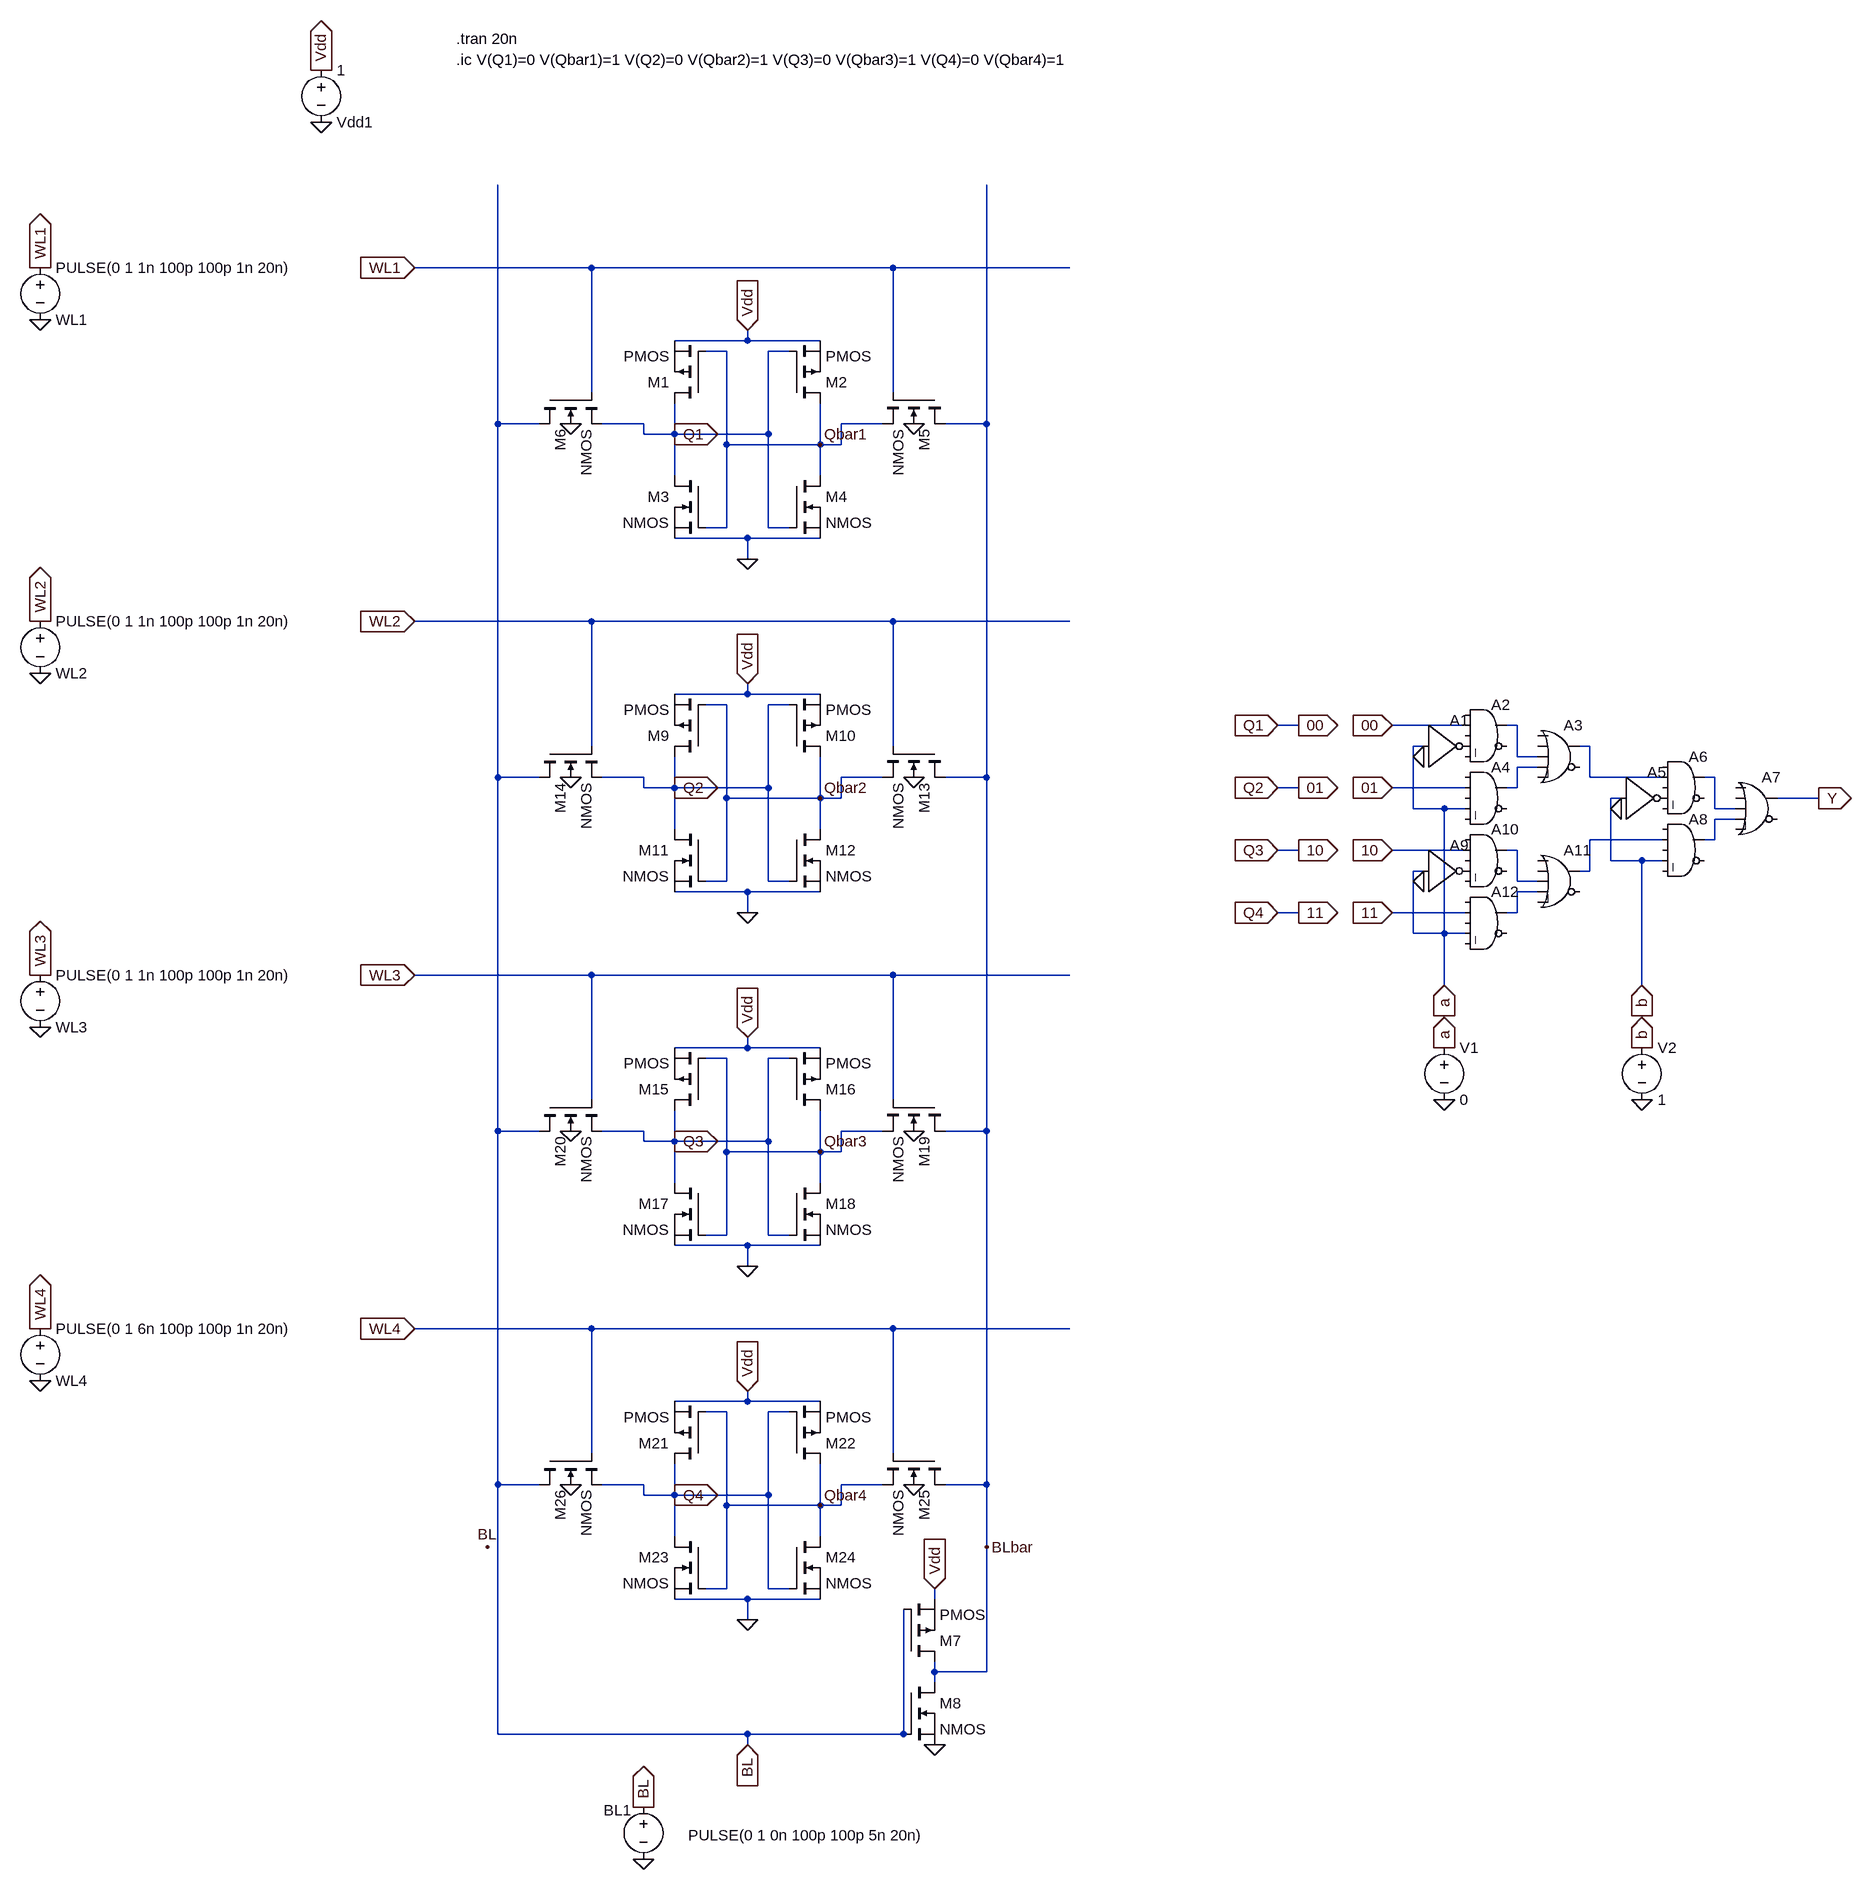
[diagram p0: schematic Programmable_LUT.asc]
Programmable_LUT.asc, the LTspice schematic file:
Version 4.1
SHEET 1 2436 2504
WIRE 240 -96 -32 -96
WIRE 704 -96 240 -96
WIRE 976 -96 704 -96
WIRE 480 16 480 0
WIRE 480 16 368 16
WIRE 592 16 480 16
WIRE 448 32 416 32
WIRE 544 32 512 32
WIRE 240 96 240 -96
WIRE 704 96 704 -96
WIRE 96 144 96 -224
WIRE 160 144 96 144
WIRE 320 144 256 144
WIRE 688 144 624 144
WIRE 848 144 848 -224
WIRE 848 144 784 144
WIRE 320 160 320 144
WIRE 368 160 368 112
WIRE 368 160 320 160
WIRE 512 160 512 32
WIRE 512 160 368 160
WIRE 448 176 448 32
WIRE 592 176 592 112
WIRE 592 176 448 176
WIRE 624 176 624 144
WIRE 624 176 592 176
WIRE 368 224 368 160
WIRE 592 224 592 176
WIRE 448 304 448 176
WIRE 448 304 416 304
WIRE 512 304 512 160
WIRE 544 304 512 304
WIRE 480 320 368 320
WIRE 592 320 480 320
WIRE 480 352 480 320
WIRE 240 448 -32 448
WIRE 704 448 240 448
WIRE 976 448 704 448
WIRE 480 560 480 544
WIRE 480 560 368 560
WIRE 592 560 480 560
WIRE 448 576 416 576
WIRE 544 576 512 576
WIRE 1328 608 1296 608
WIRE 1584 608 1472 608
WIRE 1664 608 1648 608
WIRE 240 640 240 448
WIRE 704 640 704 448
WIRE 1520 640 1504 640
WIRE 1776 640 1760 640
WIRE 1664 656 1664 608
WIRE 1696 656 1664 656
WIRE 1696 672 1664 672
WIRE 96 688 96 144
WIRE 160 688 96 688
WIRE 320 688 256 688
WIRE 688 688 624 688
WIRE 848 688 848 144
WIRE 848 688 784 688
WIRE 1776 688 1776 640
WIRE 1888 688 1776 688
WIRE 1968 688 1952 688
WIRE 320 704 320 688
WIRE 368 704 368 656
WIRE 368 704 320 704
WIRE 512 704 512 576
WIRE 512 704 368 704
WIRE 1328 704 1296 704
WIRE 1584 704 1472 704
WIRE 1664 704 1664 672
WIRE 1664 704 1648 704
WIRE 448 720 448 576
WIRE 592 720 592 656
WIRE 592 720 448 720
WIRE 624 720 624 688
WIRE 624 720 592 720
WIRE 1824 720 1808 720
WIRE 2128 720 2064 720
WIRE 1504 736 1504 640
WIRE 1552 736 1504 736
WIRE 1584 736 1552 736
WIRE 1968 736 1968 688
WIRE 2000 736 1968 736
WIRE 2000 752 1968 752
WIRE 368 768 368 704
WIRE 592 768 592 720
WIRE 1888 784 1776 784
WIRE 1968 784 1968 752
WIRE 1968 784 1952 784
WIRE 1328 800 1296 800
WIRE 1584 800 1472 800
WIRE 1664 800 1648 800
WIRE 1808 816 1808 720
WIRE 1856 816 1808 816
WIRE 1888 816 1856 816
WIRE 1520 832 1504 832
WIRE 1776 832 1776 784
WIRE 1776 832 1760 832
WIRE 448 848 448 720
WIRE 448 848 416 848
WIRE 512 848 512 704
WIRE 544 848 512 848
WIRE 1664 848 1664 800
WIRE 1696 848 1664 848
WIRE 480 864 368 864
WIRE 592 864 480 864
WIRE 1696 864 1664 864
WIRE 480 896 480 864
WIRE 1328 896 1296 896
WIRE 1584 896 1472 896
WIRE 1664 896 1664 864
WIRE 1664 896 1648 896
WIRE 1504 928 1504 832
WIRE 1552 928 1552 736
WIRE 1552 928 1504 928
WIRE 1584 928 1552 928
WIRE 240 992 -32 992
WIRE 704 992 240 992
WIRE 976 992 704 992
WIRE 1552 1008 1552 928
WIRE 1856 1008 1856 816
WIRE 480 1104 480 1088
WIRE 480 1104 368 1104
WIRE 592 1104 480 1104
WIRE 448 1120 416 1120
WIRE 544 1120 512 1120
WIRE 240 1184 240 992
WIRE 704 1184 704 992
WIRE 96 1232 96 688
WIRE 160 1232 96 1232
WIRE 320 1232 256 1232
WIRE 688 1232 624 1232
WIRE 848 1232 848 688
WIRE 848 1232 784 1232
WIRE 320 1248 320 1232
WIRE 368 1248 368 1200
WIRE 368 1248 320 1248
WIRE 512 1248 512 1120
WIRE 512 1248 368 1248
WIRE 448 1264 448 1120
WIRE 592 1264 592 1200
WIRE 592 1264 448 1264
WIRE 624 1264 624 1232
WIRE 624 1264 592 1264
WIRE 368 1312 368 1248
WIRE 592 1312 592 1264
WIRE 448 1392 448 1264
WIRE 448 1392 416 1392
WIRE 512 1392 512 1248
WIRE 544 1392 512 1392
WIRE 480 1408 368 1408
WIRE 592 1408 480 1408
WIRE 480 1440 480 1408
WIRE 240 1536 -32 1536
WIRE 704 1536 240 1536
WIRE 976 1536 704 1536
WIRE 480 1648 480 1632
WIRE 480 1648 368 1648
WIRE 592 1648 480 1648
WIRE 448 1664 416 1664
WIRE 544 1664 512 1664
WIRE 240 1728 240 1536
WIRE 704 1728 704 1536
WIRE 96 1776 96 1232
WIRE 160 1776 96 1776
WIRE 320 1776 256 1776
WIRE 688 1776 624 1776
WIRE 848 1776 848 1232
WIRE 848 1776 784 1776
WIRE 320 1792 320 1776
WIRE 368 1792 368 1744
WIRE 368 1792 320 1792
WIRE 512 1792 512 1664
WIRE 512 1792 368 1792
WIRE 448 1808 448 1664
WIRE 592 1808 592 1744
WIRE 592 1808 448 1808
WIRE 624 1808 624 1776
WIRE 624 1808 592 1808
WIRE 368 1856 368 1792
WIRE 592 1856 592 1808
WIRE 848 1872 848 1776
WIRE 448 1936 448 1808
WIRE 448 1936 416 1936
WIRE 512 1936 512 1792
WIRE 544 1936 512 1936
WIRE 480 1952 368 1952
WIRE 592 1952 480 1952
WIRE 768 1952 768 1936
WIRE 480 1984 480 1952
WIRE 768 2064 768 2048
WIRE 848 2064 848 1872
WIRE 848 2064 768 2064
WIRE 768 2080 768 2064
WIRE 96 2160 96 1776
WIRE 480 2160 96 2160
WIRE 720 2160 720 1968
WIRE 720 2160 480 2160
WIRE 480 2176 480 2160
FLAG 480 352 0
FLAG -176 -320 0
FLAG 368 160 Q1
IOPIN 368 160 Out
FLAG 592 176 Qbar1
FLAG 480 2176 BL
IOPIN 480 2176 In
FLAG 736 144 0
FLAG 208 144 0
FLAG 768 2176 0
FLAG 768 1936 Vdd
IOPIN 768 1936 In
FLAG 480 0 Vdd
IOPIN 480 0 In
FLAG -176 -400 Vdd
IOPIN -176 -400 Out
FLAG -608 -16 0
FLAG -32 -96 WL1
IOPIN -32 -96 In
FLAG -608 -96 WL1
IOPIN -608 -96 Out
FLAG 320 2352 0
FLAG 320 2272 BL
IOPIN 320 2272 Out
FLAG 480 896 0
FLAG 368 704 Q2
IOPIN 368 704 Out
FLAG 592 720 Qbar2
FLAG 736 688 0
FLAG 208 688 0
FLAG 480 544 Vdd
IOPIN 480 544 In
FLAG -32 448 WL2
IOPIN -32 448 In
FLAG 480 1440 0
FLAG 368 1248 Q3
IOPIN 368 1248 Out
FLAG 592 1264 Qbar3
FLAG 736 1232 0
FLAG 208 1232 0
FLAG 480 1088 Vdd
IOPIN 480 1088 In
FLAG -32 992 WL3
IOPIN -32 992 In
FLAG 480 1984 0
FLAG 368 1792 Q4
IOPIN 368 1792 Out
FLAG 592 1808 Qbar4
FLAG 848 1872 BLbar
FLAG 736 1776 0
FLAG 208 1776 0
FLAG 480 1632 Vdd
IOPIN 480 1632 In
FLAG -32 1536 WL4
IOPIN -32 1536 In
FLAG 80 1872 BL
FLAG -608 528 0
FLAG -608 448 WL2
IOPIN -608 448 Out
FLAG -608 1072 0
FLAG -608 992 WL3
IOPIN -608 992 Out
FLAG -608 1616 0
FLAG -608 1536 WL4
IOPIN -608 1536 Out
FLAG 1472 608 00
IOPIN 1472 608 In
FLAG 1472 704 01
IOPIN 1472 704 In
FLAG 1472 800 10
IOPIN 1472 800 In
FLAG 1472 896 11
IOPIN 1472 896 In
FLAG 1552 1008 a
IOPIN 1552 1008 In
FLAG 1856 1008 b
IOPIN 1856 1008 In
FLAG 2128 720 Y
IOPIN 2128 720 Out
FLAG 1296 608 Q1
IOPIN 1296 608 In
FLAG 1296 704 Q2
IOPIN 1296 704 In
FLAG 1296 800 Q3
IOPIN 1296 800 In
FLAG 1296 896 Q4
IOPIN 1296 896 In
FLAG 1328 608 00
IOPIN 1328 608 Out
FLAG 1328 704 01
IOPIN 1328 704 Out
FLAG 1328 800 10
IOPIN 1328 800 Out
FLAG 1328 896 11
IOPIN 1328 896 Out
FLAG 1824 736 0
FLAG 1520 656 0
FLAG 1520 848 0
FLAG 1552 1104 a
IOPIN 1552 1104 Out
FLAG 1856 1104 b
IOPIN 1856 1104 Out
FLAG 1552 1184 0
FLAG 1856 1184 0
SYMBOL pmos 416 112 R180
SYMATTR InstName M1
SYMBOL pmos 544 112 M180
SYMATTR InstName M2
SYMBOL nmos 416 224 M0
SYMATTR InstName M3
SYMBOL nmos 544 224 R0
SYMATTR InstName M4
SYMBOL voltage -176 -416 R0
WINDOW 0 24 96 Left 2
WINDOW 3 24 16 Left 2
WINDOW 123 0 0 Left 0
WINDOW 39 0 0 Left 0
SYMATTR InstName Vdd1
SYMATTR Value 1
SYMBOL voltage 320 2256 R0
WINDOW 0 -61 21 Left 2
WINDOW 3 251 44 Top 2
WINDOW 123 0 0 Left 0
WINDOW 39 0 0 Left 0
SYMATTR InstName BL1
SYMATTR Value PULSE(0 1 0n 100p 100p 5n 20n)
SYMBOL nmos4 784 96 R90
SYMATTR InstName M5
SYMBOL nmos4 160 96 M90
SYMATTR InstName M6
SYMBOL voltage -608 -112 R0
WINDOW 0 24 96 Left 2
WINDOW 3 24 16 Left 2
WINDOW 123 0 0 Left 0
WINDOW 39 0 0 Left 0
SYMATTR InstName WL1
SYMATTR Value PULSE(0 1 1n 100p 100p 1n 20n)
SYMBOL pmos 720 2048 M180
SYMATTR InstName M7
SYMBOL nmos 720 2080 R0
SYMATTR InstName M8
SYMBOL pmos 416 656 R180
SYMATTR InstName M9
SYMBOL pmos 544 656 M180
SYMATTR InstName M10
SYMBOL nmos 416 768 M0
SYMATTR InstName M11
SYMBOL nmos 544 768 R0
SYMATTR InstName M12
SYMBOL nmos4 784 640 R90
SYMATTR InstName M13
SYMBOL nmos4 160 640 M90
SYMATTR InstName M14
SYMBOL pmos 416 1200 R180
SYMATTR InstName M15
SYMBOL pmos 544 1200 M180
SYMATTR InstName M16
SYMBOL nmos 416 1312 M0
SYMATTR InstName M17
SYMBOL nmos 544 1312 R0
SYMATTR InstName M18
SYMBOL nmos4 784 1184 R90
SYMATTR InstName M19
SYMBOL nmos4 160 1184 M90
SYMATTR InstName M20
SYMBOL pmos 416 1744 R180
SYMATTR InstName M21
SYMBOL pmos 544 1744 M180
SYMATTR InstName M22
SYMBOL nmos 416 1856 M0
SYMATTR InstName M23
SYMBOL nmos 544 1856 R0
SYMATTR InstName M24
SYMBOL nmos4 784 1728 R90
SYMATTR InstName M25
SYMBOL nmos4 160 1728 M90
SYMATTR InstName M26
SYMBOL voltage -608 432 R0
WINDOW 0 24 96 Left 2
WINDOW 3 24 16 Left 2
WINDOW 123 0 0 Left 0
WINDOW 39 0 0 Left 0
SYMATTR InstName WL2
SYMATTR Value PULSE(0 1 1n 100p 100p 1n 20n)
SYMBOL voltage -608 976 R0
WINDOW 0 24 96 Left 2
WINDOW 3 24 16 Left 2
WINDOW 123 0 0 Left 0
WINDOW 39 0 0 Left 0
SYMATTR InstName WL3
SYMATTR Value PULSE(0 1 1n 100p 100p 1n 20n)
SYMBOL voltage -608 1520 R0
WINDOW 0 24 96 Left 2
WINDOW 3 24 16 Left 2
WINDOW 123 0 0 Left 0
WINDOW 39 0 0 Left 0
SYMATTR InstName WL4
SYMATTR Value PULSE(0 1 6n 100p 100p 1n 20n)
SYMBOL Digital\\inv 1520 576 R0
SYMATTR InstName A1
SYMBOL Digital\\and 1616 560 R0
SYMATTR InstName A2
SYMBOL Digital\\or 1728 592 R0
SYMATTR InstName A3
SYMBOL Digital\\and 1616 656 R0
SYMATTR InstName A4
SYMBOL Digital\\inv 1824 656 R0
SYMATTR InstName A5
SYMBOL Digital\\and 1920 640 R0
SYMATTR InstName A6
SYMBOL Digital\\or 2032 672 R0
SYMATTR InstName A7
SYMBOL Digital\\and 1920 736 R0
SYMATTR InstName A8
SYMBOL Digital\\inv 1520 768 R0
SYMATTR InstName A9
SYMBOL Digital\\and 1616 752 R0
SYMATTR InstName A10
SYMBOL Digital\\or 1728 784 R0
SYMATTR InstName A11
SYMBOL Digital\\and 1616 848 R0
SYMATTR InstName A12
SYMBOL voltage 1552 1088 R0
WINDOW 123 0 0 Left 0
WINDOW 39 0 0 Left 0
SYMATTR InstName V1
SYMATTR Value 0
SYMBOL voltage 1856 1088 R0
WINDOW 123 0 0 Left 0
WINDOW 39 0 0 Left 0
SYMATTR InstName V2
SYMATTR Value 1
TEXT 32 -448 Left 2 !.tran 20n
TEXT 32 -416 Left 2 !.ic V(Q1)=0 V(Qbar1)=1 V(Q2)=0 V(Qbar2)=1 V(Q3)=0 V(Qbar3)=1 V(Q4)=0 V(Qbar4)=1

The netlist it stands for:
* Programmable_LUT.asc
M1 00 Qbar1 Vdd Vdd PMOS
M2 Qbar1 00 Vdd Vdd PMOS
M3 00 Qbar1 0 0 NMOS
M4 Qbar1 00 0 0 NMOS
Vdd1 Vdd 0 1
V§BL1 BL 0 PULSE(0 1 0n 100p 100p 5n 20n)
M5 BLbar WL1 Qbar1 0 NMOS
M6 BL WL1 00 0 NMOS
V§WL1 WL1 0 PULSE(0 1 1n 100p 100p 1n 20n)
M7 BLbar BL Vdd Vdd PMOS
M8 BLbar BL 0 0 NMOS
M9 01 Qbar2 Vdd Vdd PMOS
M10 Qbar2 01 Vdd Vdd PMOS
M11 01 Qbar2 0 0 NMOS
M12 Qbar2 01 0 0 NMOS
M13 BLbar WL2 Qbar2 0 NMOS
M14 BL WL2 01 0 NMOS
M15 10 Qbar3 Vdd Vdd PMOS
M16 Qbar3 10 Vdd Vdd PMOS
M17 10 Qbar3 0 0 NMOS
M18 Qbar3 10 0 0 NMOS
M19 BLbar WL3 Qbar3 0 NMOS
M20 BL WL3 10 0 NMOS
M21 11 Qbar4 Vdd Vdd PMOS
M22 Qbar4 11 Vdd Vdd PMOS
M23 11 Qbar4 0 0 NMOS
M24 Qbar4 11 0 0 NMOS
M25 BLbar WL4 Qbar4 0 NMOS
M26 BL WL4 11 0 NMOS
V§WL2 WL2 0 PULSE(0 1 1n 100p 100p 1n 20n)
V§WL3 WL3 0 PULSE(0 1 1n 100p 100p 1n 20n)
V§WL4 WL4 0 PULSE(0 1 6n 100p 100p 1n 20n)
A1 a 0 0 0 0 P001 0 0 BUF
A2 0 00 0 P001 0 0 N001 0 AND
A3 0 0 N001 N003 0 0 N002 0 OR
A4 0 01 0 a 0 0 N003 0 AND
A5 b 0 0 0 0 P002 0 0 BUF
A6 0 N002 0 P002 0 0 N004 0 AND
A7 0 0 N004 N005 0 0 Y 0 OR
A8 0 N006 0 b 0 0 N005 0 AND
A9 a 0 0 0 0 P003 0 0 BUF
A10 0 10 0 P003 0 0 N007 0 AND
A11 0 0 N007 N008 0 0 N006 0 OR
A12 0 11 0 a 0 0 N008 0 AND
V1 a 0 0
V2 b 0 1
.model NMOS NMOS
.model PMOS PMOS
.lib standard.mos
.tran 20n
.ic V(Q1)=0 V(Qbar1)=1 V(Q2)=0 V(Qbar2)=1 V(Q3)=0 V(Qbar3)=1 V(Q4)=0 V(Qbar4)=1
.backanno
.end